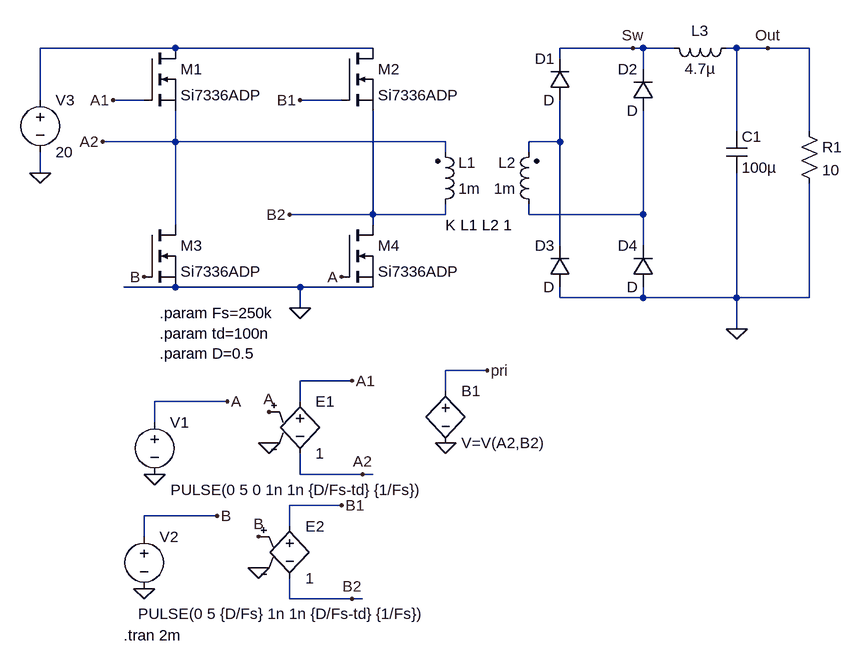
[diagram p0: schematic FullBridgeDCDC.asc]
FullBridgeDCDC.asc, the LTspice schematic file:
Version 4
SHEET 1 1736 888
WIRE 656 -32 448 -32
WIRE 960 -32 656 -32
WIRE 1360 -32 1248 -32
WIRE 1376 -32 1360 -32
WIRE 1424 -32 1376 -32
WIRE 1520 -32 1504 -32
WIRE 1568 -32 1520 -32
WIRE 1632 -32 1568 -32
WIRE 1248 -16 1248 -32
WIRE 1376 0 1376 -32
WIRE 448 48 448 -32
WIRE 608 48 560 48
WIRE 912 48 848 48
WIRE 1520 96 1520 -32
WIRE 1632 96 1632 -32
WIRE 656 112 656 64
WIRE 656 112 544 112
WIRE 1072 112 656 112
WIRE 1248 112 1248 48
WIRE 1248 112 1200 112
WIRE 1072 128 1072 112
WIRE 1200 128 1200 112
WIRE 448 160 448 128
WIRE 960 224 960 64
WIRE 960 224 832 224
WIRE 1072 224 1072 208
WIRE 1072 224 960 224
WIRE 1200 224 1200 208
WIRE 1376 224 1376 64
WIRE 1376 224 1200 224
WIRE 656 240 656 112
WIRE 960 240 960 224
WIRE 1248 272 1248 112
WIRE 1376 272 1376 224
WIRE 656 336 576 336
WIRE 848 336 656 336
WIRE 960 336 848 336
WIRE 1248 352 1248 336
WIRE 1376 352 1376 336
WIRE 1376 352 1248 352
WIRE 1520 352 1520 160
WIRE 1520 352 1376 352
WIRE 1632 352 1632 176
WIRE 1632 352 1520 352
WIRE 848 368 848 336
WIRE 1520 400 1520 352
WIRE 1136 464 1072 464
WIRE 928 480 848 480
WIRE 1072 496 1072 464
WIRE 736 512 624 512
WIRE 848 512 848 480
WIRE 624 544 624 512
WIRE 848 624 848 592
WIRE 944 624 848 624
WIRE 960 624 944 624
WIRE 912 672 832 672
WIRE 720 688 608 688
WIRE 832 704 832 672
WIRE 608 720 608 688
WIRE 832 816 832 784
WIRE 928 816 832 816
WIRE 944 816 928 816
FLAG 624 624 0
FLAG 608 800 0
FLAG 720 688 B
FLAG 800 528 A
FLAG 800 576 0
FLAG 928 480 A1
FLAG 944 624 A2
FLAG 784 720 B
FLAG 784 768 0
FLAG 912 672 B1
FLAG 848 368 0
FLAG 560 48 A1
FLAG 544 112 A2
FLAG 848 48 B1
FLAG 928 816 B2
FLAG 832 224 B2
FLAG 736 512 A
FLAG 912 320 A
FLAG 608 320 B
FLAG 1136 464 pri
FLAG 1072 576 0
FLAG 1568 -32 Out
FLAG 1360 -32 Sw
FLAG 448 160 0
FLAG 1520 400 0
SYMBOL voltage 624 528 R0
WINDOW 123 0 0 Left 0
WINDOW 39 0 0 Left 0
WINDOW 3 25 120 Left 2
SYMATTR InstName V1
SYMATTR Value PULSE(0 5 0 1n 1n {D/Fs-td} {1/Fs})
SYMBOL voltage 608 704 R0
WINDOW 3 -9 135 Left 2
WINDOW 123 0 0 Left 0
WINDOW 39 0 0 Left 0
SYMATTR Value PULSE(0 5 {D/Fs} 1n 1n {D/Fs-td} {1/Fs})
SYMATTR InstName V2
SYMBOL e 848 496 R0
SYMATTR InstName E1
SYMATTR Value 1
SYMBOL e 832 688 R0
SYMATTR InstName E2
SYMATTR Value 1
SYMBOL nmos 608 -32 R0
SYMATTR InstName M1
SYMATTR Value Si7336ADP
SYMBOL nmos 912 -32 R0
SYMATTR InstName M2
SYMATTR Value Si7336ADP
SYMBOL nmos 608 240 R0
SYMATTR InstName M3
SYMATTR Value Si7336ADP
SYMBOL nmos 912 240 R0
SYMATTR InstName M4
SYMATTR Value Si7336ADP
SYMBOL ind2 1056 224 M180
WINDOW 0 36 80 Left 2
WINDOW 3 36 40 Left 2
SYMATTR InstName L1
SYMATTR Value 1m
SYMATTR Type ind
SYMBOL bv 1072 480 R0
SYMATTR InstName B1
SYMATTR Value V=V(A2,B2)
SYMBOL ind2 1216 224 R180
WINDOW 0 36 80 Left 2
WINDOW 3 36 40 Left 2
SYMATTR InstName L2
SYMATTR Value 1m
SYMATTR Type ind
SYMBOL diode 1264 48 R180
WINDOW 0 24 64 Left 2
WINDOW 3 24 0 Left 2
SYMATTR InstName D1
SYMBOL diode 1392 64 R180
WINDOW 0 24 64 Left 2
WINDOW 3 24 0 Left 2
SYMATTR InstName D2
SYMBOL diode 1264 336 R180
WINDOW 0 24 64 Left 2
WINDOW 3 24 0 Left 2
SYMATTR InstName D3
SYMBOL diode 1392 336 R180
WINDOW 0 24 64 Left 2
WINDOW 3 24 0 Left 2
SYMATTR InstName D4
SYMBOL cap 1504 96 R0
SYMATTR InstName C1
SYMATTR Value 100µ
SYMBOL ind 1520 -48 R90
WINDOW 0 5 56 VBottom 2
WINDOW 3 32 56 VTop 2
SYMATTR InstName L3
SYMATTR Value 4.7µ
SYMBOL res 1616 80 R0
SYMATTR InstName R1
SYMATTR Value 10
SYMBOL voltage 448 32 R0
SYMATTR InstName V3
SYMATTR Value 20
TEXT 632 376 Left 2 !.param Fs=250k\n.param td=100n\n.param D=0.5
TEXT 576 872 Left 2 !.tran 2m
TEXT 1072 240 Left 2 !K L1 L2 1

The netlist it stands for:
* FullBridgeDCDC.asc
V1 A 0 PULSE(0 5 0 1n 1n {D/Fs-td} {1/Fs})
V2 B 0 PULSE(0 5 {D/Fs} 1n 1n {D/Fs-td} {1/Fs})
E1 A1 A2 A 0 1
E2 B1 B2 B 0 1
M1 N001 A1 A2 A2 Si7336ADP
M2 N001 B1 B2 B2 Si7336ADP
M3 A2 B 0 0 Si7336ADP
M4 B2 A 0 0 Si7336ADP
L1 B2 A2 1m
B1 pri 0 V=V(A2,B2)
L2 N003 N002 1m
D1 N002 Sw D
D2 N003 Sw D
D3 0 N002 D
D4 0 N003 D
C1 Out 0 100µ
L3 Out Sw 4.7µ
R1 Out 0 10
V3 N001 0 20
.model D D
.lib standard.dio
.model NMOS NMOS
.model PMOS PMOS
.lib standard.mos
.param Fs=250k
.param td=100n
.param D=0.5
.tran 2m
K L1 L2 1
.backanno
.end